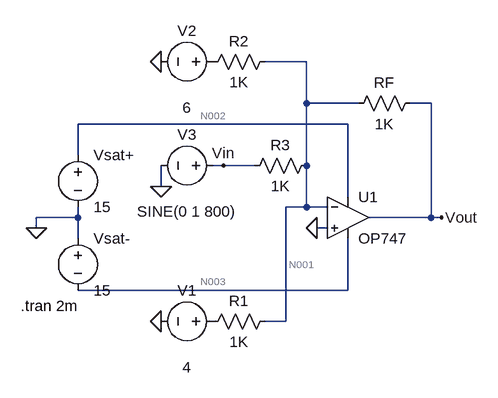
[diagram p0: schematic INVERTING_SUMMER.asc]
INVERTING_SUMMER.asc, the LTspice schematic file:
Version 4
SHEET 1 880 680
WIRE 272 -80 208 -80
WIRE 272 -16 272 -80
WIRE 352 -16 272 -16
WIRE 464 -16 432 -16
WIRE 336 16 -80 16
WIRE -80 64 -80 16
WIRE 144 80 128 80
WIRE 192 80 144 80
WIRE 272 80 272 -16
WIRE 48 112 48 80
WIRE 336 128 336 16
WIRE 272 144 272 80
WIRE 272 144 240 144
WIRE 304 144 272 144
WIRE -80 160 -80 144
WIRE -80 160 -144 160
WIRE 464 160 464 -16
WIRE 464 160 368 160
WIRE 480 160 464 160
WIRE -144 176 -144 160
WIRE 304 176 288 176
WIRE -80 192 -80 160
WIRE 336 272 336 192
WIRE 336 272 -80 272
WIRE 240 320 240 144
WIRE 240 320 208 320
FLAG -144 176 0
FLAG 48 112 0
FLAG 480 160 Vout
FLAG 144 80 Vin
FLAG 48 -80 0
FLAG 48 320 0
FLAG 288 176 0
SYMBOL OpAmps\\OP747 336 96 R0
SYMATTR InstName U1
SYMBOL voltage -80 48 R0
WINDOW 123 0 0 Left 0
WINDOW 39 0 0 Left 0
SYMATTR InstName Vsat+
SYMATTR Value 15
SYMBOL voltage -80 176 R0
WINDOW 123 0 0 Left 0
WINDOW 39 0 0 Left 0
SYMATTR InstName Vsat-
SYMATTR Value 15
SYMBOL voltage 144 80 R90
WINDOW 0 -32 56 VBottom 2
WINDOW 3 55 56 VTop 2
WINDOW 123 0 0 Left 0
WINDOW 39 0 0 Left 0
SYMATTR InstName V3
SYMATTR Value SINE(0 1 800)
SYMBOL voltage 144 320 R90
WINDOW 0 -32 56 VBottom 2
WINDOW 3 55 56 VTop 2
WINDOW 123 0 0 Left 0
WINDOW 39 0 0 Left 0
SYMATTR InstName V1
SYMATTR Value 4
SYMBOL voltage 144 -80 R90
WINDOW 0 -32 56 VBottom 2
WINDOW 3 55 56 VTop 2
WINDOW 123 0 0 Left 0
WINDOW 39 0 0 Left 0
SYMATTR InstName V2
SYMATTR Value 6
SYMBOL res 224 -96 R90
WINDOW 0 0 56 VBottom 2
WINDOW 3 32 56 VTop 2
SYMATTR InstName R2
SYMATTR Value 1K
SYMBOL res 448 -32 R90
WINDOW 0 0 56 VBottom 2
WINDOW 3 32 56 VTop 2
SYMATTR InstName RF
SYMATTR Value 1K
SYMBOL res 288 64 R90
WINDOW 0 0 56 VBottom 2
WINDOW 3 32 56 VTop 2
SYMATTR InstName R3
SYMATTR Value 1K
SYMBOL res 224 304 R90
WINDOW 0 0 56 VBottom 2
WINDOW 3 32 56 VTop 2
SYMATTR InstName R1
SYMATTR Value 1K
TEXT -168 296 Left 2 !.tran 2m

The netlist it stands for:
* INVERTING_SUMMER.asc
XU1 0 N001 N002 N003 Vout OP747  ; pins In+ In- V+ V- OUT
Vsat+ N002 0 15
Vsat- 0 N003 15
V3 Vin 0 SINE(0 1 800)
V1 P001 0 4
V2 P002 0 6
R2 N001 P002 1K
RF Vout N001 1K
R3 N001 Vin 1K
R1 N001 P001 1K
.tran 2m
.backanno
.end

* Results of the author's LTspice run, read from the files saved beside the schematic
* Operating Point, zero values left out:
*   V(n001) = 118.1 µV
*   V(n003) = -15 V
*   V(n002) = 15 V
*   V(vout) = -10 V
*   V(p001) = 4 V
*   V(p002) = 6 V
*   I(R1) = -4 mA
*   I(R3) = 118.1 nA
*   I(Rf) = -10 mA
*   I(R2) = -6 mA
*   I(V2) = -6 mA
*   I(V1) = -4 mA
*   I(V3) = 118.1 nA
*   I(Vsat-) = -10.13 mA
*   I(Vsat+) = -128 µA
*   Ix(u1:1) = -10.86 nA
*   Ix(u1:2) = -8.849 nA
*   Ix(u1:99) = 128 µA
*   Ix(u1:50) = -10.13 mA
*   Ix(u1:45) = 10 mA
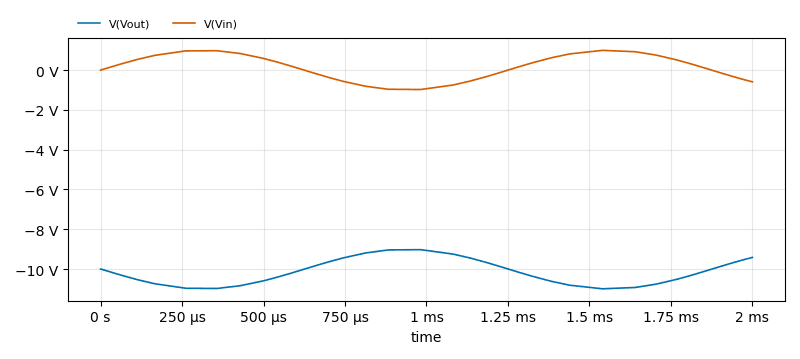
[diagram p1: Transient Analysis of INVERTING_SUMMER.asc, plotted from the saved traces]
* Transient Analysis, 1 run:
*   V(Vout): min -10.99 V, max -9.024 V, average -10.18 V, rms 10.2 V, last -9.416 V
*   V(Vin): min -974.4 mV, max 993.2 mV, average 177.3 mV, rms 683.6 mV, last -587.8 mV